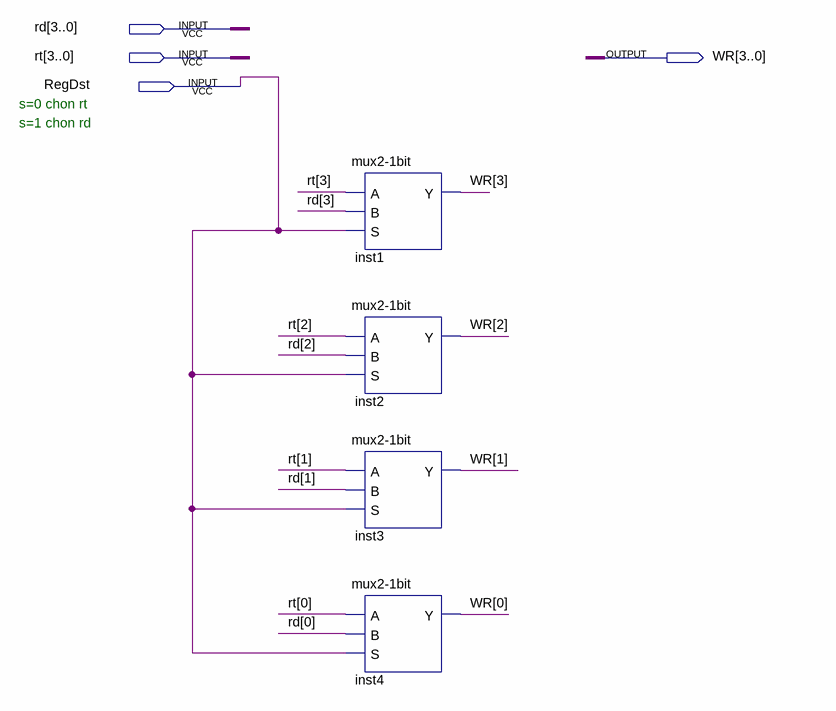
[diagram p0: schematic sheet]
// Quartus schematic MUX21_4BITS.bdf as structural Verilog: 4 symbols, 4 pins
module MUX21_4BITS (
  input  [3:0] rd,
  input  [3:0] rt,
  input  RegDst,
  output [3:0] WR
);

  \mux2-1bit  inst1 (.A(rt[3]), .B(rd[3]), .S(RegDst), .Y(WR[3]));
  \mux2-1bit  inst2 (.A(rt[2]), .B(rd[2]), .S(RegDst), .Y(WR[2]));
  \mux2-1bit  inst3 (.A(rt[1]), .B(rd[1]), .S(RegDst), .Y(WR[1]));
  \mux2-1bit  inst4 (.A(rt[0]), .B(rd[0]), .S(RegDst), .Y(WR[0]));

  // Notes on the sheet:
  //   s=0 chon rt
  //   s=1 chon rd
endmodule
